# Altium project Feeder.PrjPCB
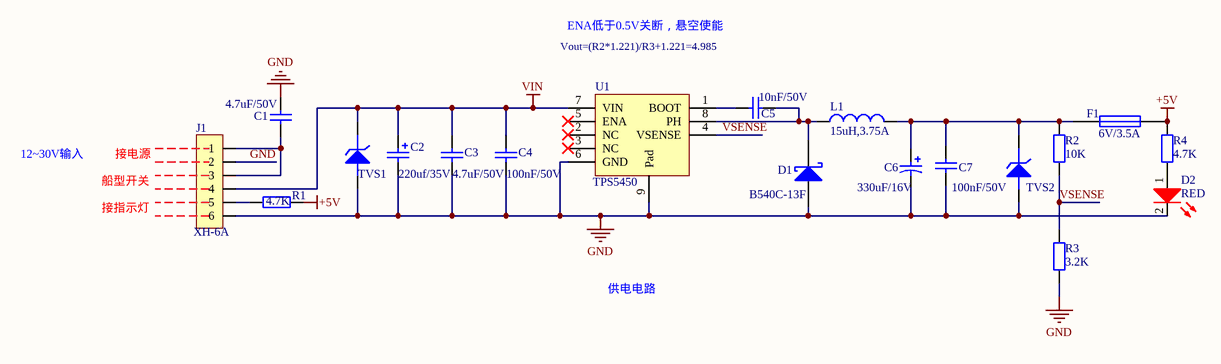
[diagram p0: Power.SchDoc]
5 sheets, 131 parts. Net scope: global (net labels, ports and power ports of the same name join across sheets).
Board file: Feeder.PcbDoc
Sheets:
  Power.SchDoc
  MCU.SchDoc
  Motor.SchDoc
  Communicate.SchDoc
  Display.SchDoc

## Sheet Power.SchDoc
size A4; PageSetup: Record=PageOptions|CenterHorizontal=True|CenterVertical=True|PrintScale=0.97|XCorrection=1.00|YCorrection=1.00|PrintKind=0|BorderSize=5000000|LeftOffset=0|BottomOffset=0|Orientation=2|PaperLength=1000|PaperWidth=1000|Scale=100|PaperSource=7|PrintQuality=-4|MediaType=1|DitherType=10|PaperKind=A4|PrintScaleMode=1

### Parts
C1  4.7uF/50V  [0603C]
C2  220uf/35V  [CES-8x10R5mm]
C3  4.7uF/50V  [0603C]
C4  100nF/50V  [0603C]
C5  10nF/50V  [0603C]
C6  330uF/16V  [CES-8 X11R7MM]
C7  100nF/50V  [0603C]
D1  B540C-13F  [SMC]
D2  RED  [0603D]
F1  6V/3.5A  [F1812]
J1  XH-6A  [CN6-2.54]
L1  15uH,3.75A  [L12*12*6]
R1  4.7K  [0603R]
R2  10K  [0603R]
R3  3.2K  [0603R]
R4  4.7K  [0603R]
TVS1  1SMA26CAT3G  [DO-214AC]  (value not drawn)
TVS2  1SMA6.0AT3D  [DO-214AC]  (value not drawn)
U1  TPS5450  [SOIC8-P]

### Nets
+5V: F1.2 R1.1 R4.2
GND: C1.2 C2.2 C3.1 C4.1 C6.2 C7.1 D1.1 D2.2 J1.2 J1.6 R3.1 TVS1.1 TVS2.1 U1.6(GND) U1.9(Pad)
VIN: C2.1 C3.2 C4.2 J1.4 TVS1.2 U1.7(VIN)
VSENSE: R2.2 R3.2 U1.4(VSENSE)
NetC1_1: C1.1 J1.1 J1.3
NetC5_1: C5.1 U1.1(BOOT)
NetC5_2: C5.2 D1.2 L1.1 U1.8(PH)
NetC6_1: C6.1 C7.2 F1.1 L1.2 R2.1 TVS2.2
NetD2_1: D2.1 R4.1
NetJ1_5: J1.5 R1.2

Not connected (* = marked no-connect by the designer): U1 2(NC)* 3(NC)* 5(ENA)*

### Notes on the sheet
- Vout=(R2*1.221)/R3+1.221=4.985
- ENA低于0.5V关断，悬空使能
- 12~30V输入
- 船型开关
- 接指示灯
- 接电源
- 供电电路
- Shen Zhen Strong Technology Co,.LTD
- 深圳市思榕科技有限公司
- Title:
- PN:
- APPD（核准）:
- Date:
- CHK（审核）:
- DR（绘图）:
- Rev:
- Sheet:
- of

### Library data of the parts
C1 C3 = C4.7uF-0603: 瓷片电容,4.7uF,5%,X7R,50V,0603; 料号: 10201-47042-00; 品名: 瓷片电容
C2 = C220uf/35V-8*11.5: 铝电解电容,220uF,20%,35V,8*11.5; 料号: 10202-22069-00; 品名: 铝电解电容
C4 C7 = C100nF/50V-0603: 瓷片电容,100nF,5%,X7R,50V,0603; 料号: 10201-10032-00; 品名: 瓷片电容
C5 = C10nF/50V-0603: 瓷片电容,10nF,5%,X7R,50V,0603; 料号: 10201-10022-00; 品名: 瓷片电容
C6 = C330uF/16V-8*11.7: 铝电解电容，330uF/16V，8*11.7; 品名: 铝电解电容; 料号: 10202-3307G-00
D1 = B540C-13-F: 肖特基二极管, 40V/5A, SMC（DO-214AB）封装; 料号: 10403-00014-00; 品名: 肖特基二极管
D2 = LED-RED-0603: LED，红光，0603; 料号: 10406-00008-00; 品名: 发光二极管
F1 = F-6V/3.5A: 保险丝,6V,3.5A,慢断,1812封装; 料号: 11001-00023-00; 品名: 保险丝
J1 = CONN-XH-6A: CONN,XH-6A,6PIN,2.54mm插座; 料号: 10701-00013-00; 品名: 线对板连接器
L1 = L15uH-12*12*6: 744771115，15uH，±20%，3.75A，外形尺寸：12x12x6mm; 料号: 10301-01014-00; 品名: 功率电感
R1 R4 = R4.7K-0603: 金属膜电阻,4.7K,1%,1/10W,0603; 料号: 10101-47012-00; 品名: 金属膜电阻
R2 = R10K-0603-0.1%: 金属膜电阻,10K,0.1%,1/10W,0603; 料号: 10101-1002B-00; 品名: 金属膜电阻
R3 = R3.2K-0603-0.1%: 金属膜电阻,3.2KK,0.1%,1/10W,0603; 料号: 10101-03201-00; 品名: 金属膜电阻
TVS1 = 1SMA26CAT3G: TVS管，1SMA26CAT3G，DO214AC封装（SMA）; 料号: 10405-00033-00; 品名: TVS管
TVS2 = 1SMA6.0AT3D: TVS管，1SMA6.0AT3D，DO214AC封装（SMA）; 料号: 10405-00035-00; 品名: TVS管
U1 = TPS5450: 线性稳压器，SOIC-8封装，; 产品料号: 10604-00141-00; 品名: 电源芯片

## Sheet MCU.SchDoc
size A4; PageSetup: Record=PageOptions|CenterHorizontal=True|CenterVertical=True|PrintScale=0.97|XCorrection=1.00|YCorrection=1.00|PrintKind=0|BorderSize=5000000|LeftOffset=0|BottomOffset=0|Orientation=2|PaperLength=1000|PaperWidth=1000|Scale=100|PaperSource=7|PrintQuality=-4|MediaType=1|DitherType=10|PaperKind=A4|PrintScaleMode=1
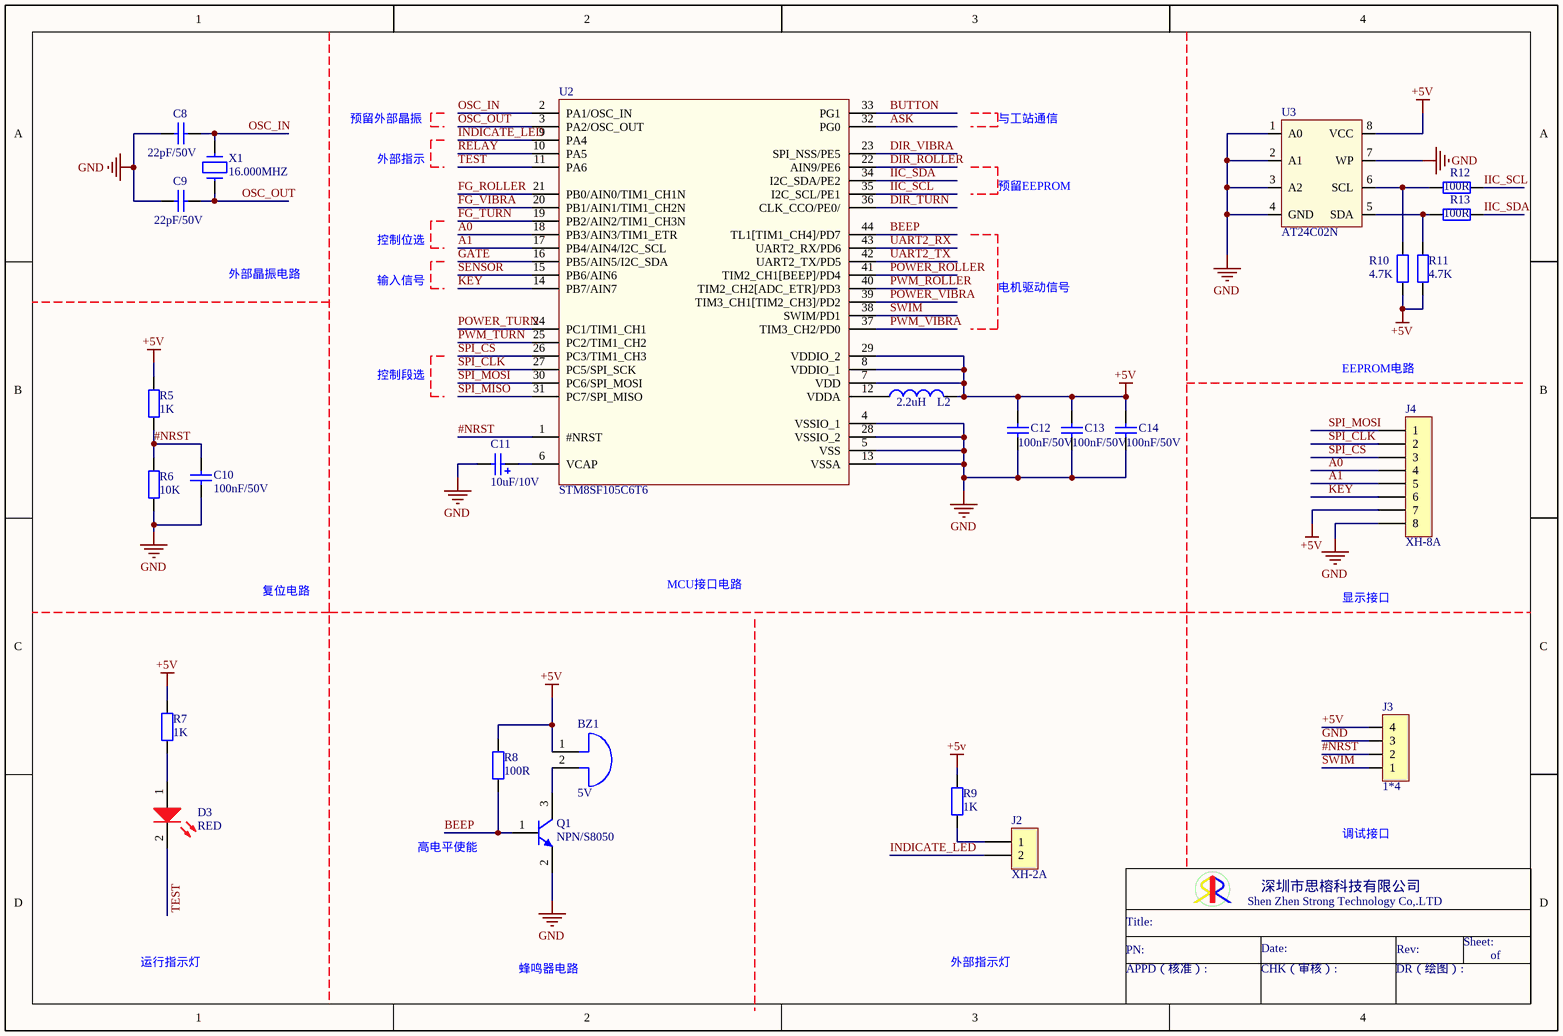
[diagram p1: MCU.SchDoc]

### Parts
BZ1  5V  [BUZZER]
C8  22pF/50V  [0603C]
C9  22pF/50V  [0603C]
C10  100nF/50V  [0603C]
C11  10uF/10V  [3216]
C12  100nF/50V  [0603C]
C13  100nF/50V  [0603C]
C14  100nF/50V  [0603C]
D3  RED  [0603D]
J2  XH-2A  [CN2-2.54]
J3  1*4  [SIP4-2.54mm]
J4  XH-8A  [PH2.0MM-8PIN]
L2  2.2uH  [0805L]
Q1  NPN/S8050  [SOT-23]
R5  1K  [0603R]
R6  10K  [0603R]
R7  1K  [0603R]
R8  100R  [0603R]
R9  1K  [0603R]
R10  4.7K  [0603R]
R11  4.7K  [0603R]
R12  100R  [0603R]
R13  100R  [0603R]
U2  STM8SF105C6T6  [LQFP44]
U3  AT24C02N  [SOP8]
X1  16.000MHZ  [CRYL3*5]

### Nets
+5V: BZ1.1 C12.2 C13.2 C14.2 J3.4 J4.7 L2.2 R5.2 R7.1 R8.2 R9.2 R10.1 R11.1 U2.7(VDD) U2.8(VDDIO_1) U2.29(VDDIO_2) U3.8(VCC)
GND: C8.2 C9.2 C10.1 C11.2 C12.1 C13.1 C14.1 J3.3 J4.8 Q1.2(E) R6.1 U2.4(VSSIO_1) U2.5(VSS) U2.13(VSSA) U2.28(VSSIO_2) U3.1(A0) U3.2(A1) U3.3(A2) U3.4(GND) U3.7(WP)
#NRST: C10.2 J3.2 R5.1 R6.2 U2.1(#NRST)
A0: J4.4 U2.18(PB3/AIN3/TIM1_ETR)
A1: J4.5 U2.17(PB4/AIN4/I2C_SCL)
ASK: U2.32(PG0)
BEEP: Q1.1(B) R8.1 U2.44(TL1[TIM1_CH4]/PD7)
BUTTON: U2.33(PG1)
DIR_ROLLER: U2.22(AIN9/PE6)
DIR_TURN: U2.36(CLK_CCO/PE0/)
DIR_VIBRA: U2.23(SPI_NSS/PE5)
FG_ROLLER: U2.21(PB0/AIN0/TIM1_CH1N)
FG_TURN: U2.19(PB2/AIN2/TIM1_CH3N)
FG_VIBRA: U2.20(PB1/AIN1/TIM1_CH2N)
GATE: U2.16(PB5/AIN5/I2C_SDA)
IIC_SCL: R12.2 U2.35(I2C_SCL/PE1)
IIC_SDA: R13.2 U2.34(I2C_SDA/PE2)
INDICATE_LED: J2.2 U2.9(PA4)
KEY: J4.6 U2.14(PB7/AIN7)
OSC_IN: C8.1 U2.2(PA1/OSC_IN) X1.2
OSC_OUT: C9.1 U2.3(PA2/OSC_OUT) X1.1
POWER_ROLLER: U2.41(TIM2_CH1[BEEP]/PD4)
POWER_TURN: U2.24(PC1/TIM1_CH1)
POWER_VIBRA: U2.39(TIM3_CH1[TIM2_CH3]/PD2)
PWM_ROLLER: U2.40(TIM2_CH2[ADC_ETR]/PD3)
PWM_TURN: U2.25(PC2/TIM1_CH2)
PWM_VIBRA: U2.37(TIM3_CH2/PD0)
RELAY: U2.10(PA5)
SENSOR: U2.15(PB6/AIN6)
SPI_CLK: J4.2 U2.27(PC5/SPI_SCK)
SPI_CS: J4.3 U2.26(PC3/TIM1_CH3)
SPI_MISO: U2.31(PC7/SPI_MISO)
SPI_MOSI: J4.1 U2.30(PC6/SPI_MOSI)
SWIM: J3.1 U2.38(SWIM/PD1)
TEST: D3.2 U2.11(PA6)
UART2_RX: U2.43(UART2_RX/PD6)
UART2_TX: U2.42(UART2_TX/PD5)
NetBZ1_2: BZ1.2 Q1.3(C)
NetC11_1: C11.1 U2.6(VCAP)
NetD3_1: D3.1 R7.2
NetJ2_1: J2.1 R9.1
NetL2_1: L2.1 U2.12(VDDA)
NetR10_2: R10.2 R12.1 U3.6(SCL)
NetR11_2: R11.2 R13.1 U3.5(SDA)

### Notes on the sheet
- 预留外部晶振
- 外部指示
- 与工站通信
- 控制位选
- 预留EEPROM
- 外部晶振电路
- 输入信号
- 电机驱动信号
- 控制段选
- EEPROM电路
- 复位电路
- MCU接口电路
- 显示接口
- 高电平使能
- 调试接口
- 运行指示灯
- 蜂鸣器电路
- 外部指示灯
- Shen Zhen Strong Technology Co,.LTD
- 深圳市思榕科技有限公司
- Title:
- PN:
- APPD（核准）:
- Date:
- CHK（审核）:
- DR（绘图）:
- Rev:
- Sheet:
- of

### Library data of the parts
BZ1 = BEEP-5V: Ф11.8*9.5，DC5V; 料号: 11302-00002-00; 品名: 蜂鸣器
C8 C9 = C22pF/50V-0603: 瓷片电容,22pF,5%,X7R,50V,0603; 料号: 10201-02202-00; 品名: 瓷片电容
C10 C12-C14 = C100nF/50V-0603: as C4 on sheet Power; 品名: 瓷片电容
C11 = C10uF/10V-A: 钽电容,10uF,10%,10V,3216(A); 料号: 10203-10053-00; 品名: 钽电容
D3 = LED-RED-0603: as D2 on sheet Power
J2 = CONN-XH-2A: CONN,XH-2A,2PIN,2.54mm插座; 料号: 10701-00001-00; 品名: 线对板连接器
J3 = SIP1*4-FM: 单排母，1*4,2.54mm; 料号: 10701-00084-00; 品名: 线对板连接器
J4 = CONN-XH-8A: CONN,XH-8A,8PIN,2.54mm插座; 料号: 10701-00016-00; 品名: 线对板连接器
L2 = L2.2uH-0805: 磁珠,2.2uH,0805; 料号: 10302-2U203-00; 品名: 磁珠
Q1 = S8050: NPN型三极管，S8050，SOT－23; 料号: 10501-00001-00; 品名: NPN型三极管
R5 R7 R9 = R1K-0603: 金属膜电阻,1K,1%,1/10W,0603; 料号: 10101-10012-00; 品名: 金属膜电阻
R6 = R10K-0603: 金属膜电阻,10K,1%,1/10W,0603; 料号: 10101-10022-00; 品名: 金属膜电阻
R8 R12 R13 = R100R-0603: 金属膜电阻,100R,1%,1/10W,0603; 料号: 10101-10002-00; 品名: 金属膜电阻
R10 R11 = R4.7K-0603: as R1 on sheet Power; 品名: 金属膜电阻
U2 = STM8SF105C6T6: MCU,STM8SF105C6T6,LQFP44; 料号: 10601-00045-3H; 品名: MCU
U3 = AT24C02N: IC，AT24C02N，SOP8; 料号: 10603-00003-5H; 品名: 存储器
X1 = CRYSTAL: 无源晶振，16.000MHZ，贴片2脚，5.0*3.2*1.2; 品名: 无源晶振

## Sheet Motor.SchDoc
size A4; PageSetup: Record=PageOptions|CenterHorizontal=True|CenterVertical=True|PrintScale=0.97|XCorrection=1.00|YCorrection=1.00|PrintKind=0|BorderSize=5000000|LeftOffset=0|BottomOffset=0|Orientation=2|PaperLength=1000|PaperWidth=1000|Scale=100|PaperSource=7|PrintQuality=-4|MediaType=1|DitherType=10|PaperKind=A4|PrintScaleMode=1
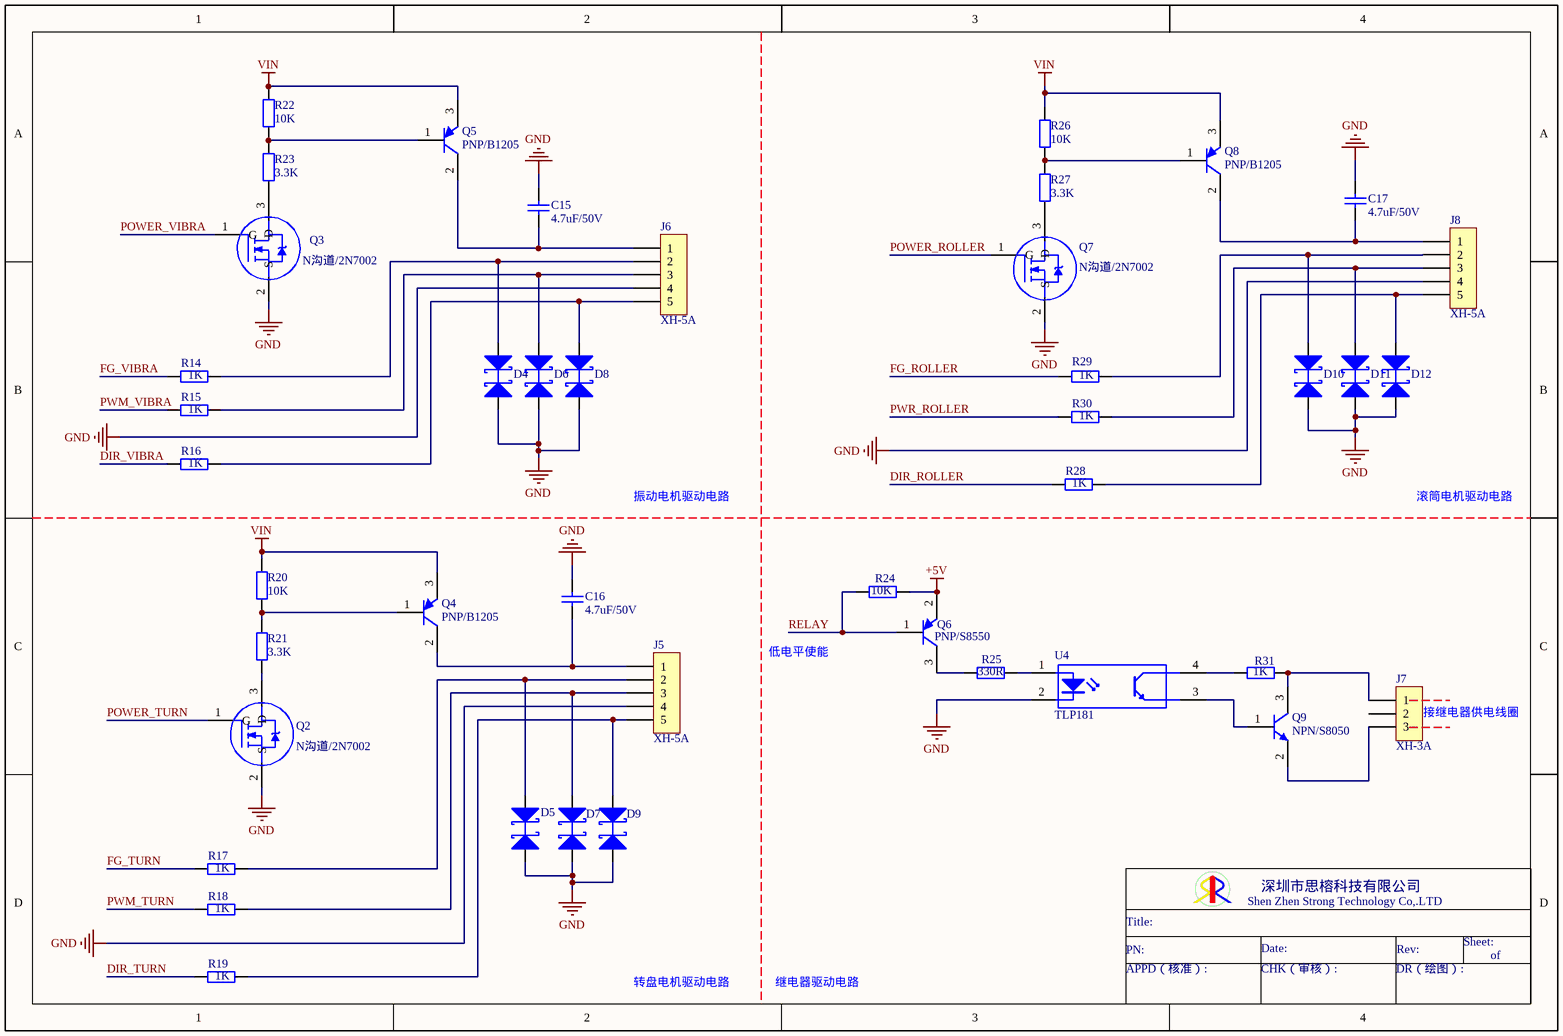
[diagram p2: Motor.SchDoc]

### Parts
C15  4.7uF/50V  [0603C]
C16  4.7uF/50V  [0603C]
C17  4.7uF/50V  [0603C]
D4  ESD5B5.0ST1G  [SOD-523]  (value not drawn)
D5  ESD5B5.0ST1G  [SOD-523]  (value not drawn)
D6  ESD5B5.0ST1G  [SOD-523]  (value not drawn)
D7  ESD5B5.0ST1G  [SOD-523]  (value not drawn)
D8  ESD5B5.0ST1G  [SOD-523]  (value not drawn)
D9  ESD5B5.0ST1G  [SOD-523]  (value not drawn)
D10  ESD5B5.0ST1G  [SOD-523]  (value not drawn)
D11  ESD5B5.0ST1G  [SOD-523]  (value not drawn)
D12  ESD5B5.0ST1G  [SOD-523]  (value not drawn)
J5  XH-5A  [CN5-2.54]
J6  XH-5A  [CN5-2.54]
J7  XH-3A  [CN3-2.54]
J8  XH-5A  [CN5-2.54]
Q2  N沟道/2N7002  [SOT-23]
Q3  N沟道/2N7002  [SOT-23]
Q4  PNP/B1205  [TO-252]
Q5  PNP/B1205  [TO-252]
Q6  PNP/S8550  [SOT-23]
Q7  N沟道/2N7002  [SOT-23]
Q8  PNP/B1205  [TO-252]
Q9  NPN/S8050  [TO-92MOD]
R14  1K  [0603R]
R15  1K  [0603R]
R16  1K  [0603R]
R17  1K  [0603R]
R18  1K  [0603R]
R19  1K  [0603R]
R20  10K  [0603R]
R21  3.3K  [0805R]
R22  10K  [0603R]
R23  3.3K  [0805R]
R24  10K  [0603R]
R25  330R  [0603R]
R26  10K  [0603R]
R27  3.3K  [0805R]
R28  1K  [0603R]
R29  1K  [0603R]
R30  1K  [0603R]
R31  1K  [0603R]
U4  TLP181  [SOP4-2.54]

### Nets
+5V: Q6.2(E) R24.1
GND: C15.2 C16.2 C17.2 D4.2 D5.2 D6.2 D7.2 D8.2 D9.2 D10.2 D11.2 D12.2 J5.4 J6.4 J8.4 Q2.2(S) Q3.2(S) Q7.2(S) U4.2(K)
VIN: Q4.3(E) Q5.3(E) Q8.3(E) R20.1 R22.2 R26.1
DIR_ROLLER: R28.1
DIR_TURN: R19.1
DIR_VIBRA: R16.1
FG_ROLLER: R29.1
FG_TURN: R17.1
FG_VIBRA: R14.1
POWER_ROLLER: Q7.1(G)
POWER_TURN: Q2.1(G)
POWER_VIBRA: Q3.1(G)
PWM_TURN: R18.1
PWM_VIBRA: R15.1
PWR_ROLLER: R30.1
RELAY: Q6.1(B) R24.2
NetC15_1: C15.1 J6.1 Q5.2(C)
NetC16_1: C16.1 J5.1 Q4.2(C)
NetC17_1: C17.1 J8.1 Q8.2(C)
NetD4_1: D4.1 J6.2 R14.2
NetD5_1: D5.1 J5.2 R17.2
NetD6_1: D6.1 J6.3 R15.2
NetD7_1: D7.1 J5.3 R18.2
NetD8_1: D8.1 J6.5 R16.2
NetD9_1: D9.1 J5.5 R19.2
NetD10_1: D10.1 J8.2 R29.2
NetD11_1: D11.1 J8.3 R30.2
NetD12_1: D12.1 J8.5 R28.2
NetJ7_1: J7.1 Q9.3(C) R31.2
NetJ7_3: J7.3 Q9.2(E)
NetQ2_3: Q2.3(D) R21.1
NetQ3_3: Q3.3(D) R23.1
NetQ4_1: Q4.1(B) R20.2 R21.2
NetQ5_1: Q5.1(B) R22.1 R23.2
NetQ6_3: Q6.3(C) R25.1
NetQ7_3: Q7.3(D) R27.1
NetQ8_1: Q8.1(B) R26.2 R27.2
NetQ9_1: Q9.1(B) U4.3(E)
NetR25_2: R25.2 U4.1(A)
NetR31_1: R31.1 U4.4(C)

Not connected (* = marked no-connect by the designer): J7 2

### Notes on the sheet
- 振动电机驱动电路
- 滚筒电机驱动电路
- 低电平使能
- (near J7) 接继电器供电线圈
- 转盘电机驱动电路
- 继电器驱动电路
- Shen Zhen Strong Technology Co,.LTD
- 深圳市思榕科技有限公司
- Title:
- PN:
- APPD（核准）:
- Date:
- CHK（审核）:
- DR（绘图）:
- Rev:
- Sheet:
- of

### Library data of the parts
C15-C17 = C4.7uF-0603: as C1 on sheet Power; 品名: 瓷片电容
D4-D12 = ESD5B5.0ST1G: TVS管,5V,SOD-523; 料号: 10405-00037-00; 品名: TVS管
J5 J6 J8 = CONN-XH-5A: CONN,XH-5A,5PIN,2.54mm插座; 料号: 10701-00010-00; 品名: 线对板连接器
J7 = CONN-XH-3A: CONN,XH-3A,3PIN,2.54mm插座; 料号: 10701-00004-00; 品名: 线对板连接器
Q2 Q3 Q7 = 2N7002: N沟道场效应管，2N7002，SOT-23; 料号: 10503-00003-1H; 品名: N沟道场效应管
Q4 Q5 Q8 = B1205: PNP型三极管，B1205，SOT－23; 品名: PNP型三极管
Q6 = S8550: PNP型三极管，S8550，SOT－23; 料号: 10502-00001-00; 品名: PNP型三极管
Q9 = S8050: NPN型三极管，S8050，SOT－23; 料号: 10501-00001-00; 品名: NPN型三极管
R14-R19 R28-R31 = R1K-0603: as R5 on sheet MCU; 品名: 金属膜电阻
R20 R22 R24 R26 = R10K-0603: as R6 on sheet MCU; 品名: 金属膜电阻
R21 R23 R27 = R3.3K-0603: 金属膜电阻,3.3K,1%,1/10W,0603; 料号: 10101-33012-00; 品名: 金属膜电阻
R25 = R33R-0805: 金属膜电阻,330R,1%,1/10W,0603; 料号: 10101-03303-00; 品名: 金属膜电阻
U4 = TLP181: 光耦，TLP181，SOP4; 料号: 10609-00009-9J; 品名: 光耦

## Sheet Communicate.SchDoc
size A4; PageSetup: Record=PageOptions|CenterHorizontal=True|CenterVertical=True|PrintScale=0.97|XCorrection=1.00|YCorrection=1.00|PrintKind=0|BorderSize=5000000|LeftOffset=0|BottomOffset=0|Orientation=2|PaperLength=1000|PaperWidth=1000|Scale=100|PaperSource=7|PrintQuality=-4|MediaType=1|DitherType=10|PaperKind=A4|PrintScaleMode=1
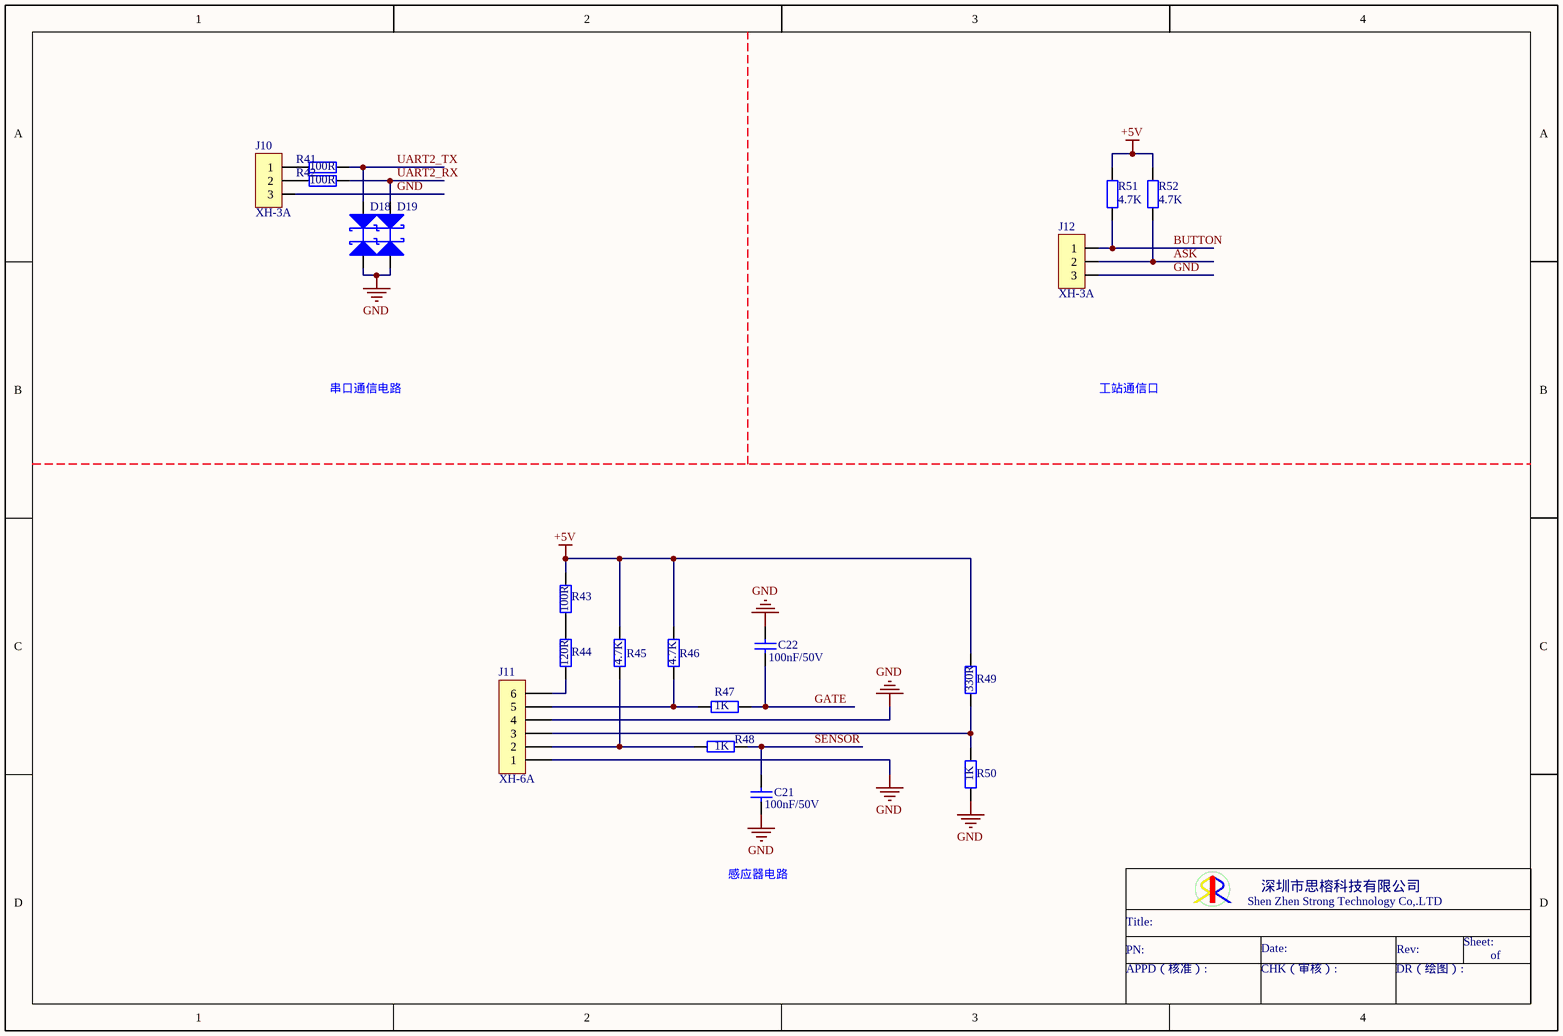
[diagram p3: Communicate.SchDoc]

### Parts
C21  100nF/50V  [0603C]
C22  100nF/50V  [0603C]
D18  ESD5B5.0ST1G  [SOD-523]  (value not drawn)
D19  ESD5B5.0ST1G  [SOD-523]  (value not drawn)
J10  XH-3A  [CN3-2.54]
J11  XH-6A  [CN6-2.54]
J12  XH-3A  [CN3-2.54]
R41  100R  [0603R]
R42  100R  [0603R]
R43  100R  [0603R]
R44  120R  [0603R]
R45  4.7K  [0603R]
R46  4.7K  [0603R]
R47  1K  [0603R]
R48  1K  [0603R]
R49  330R  [0603R]
R50  1K  [0603R]
R51  4.7K  [0603R]
R52  4.7K  [0603R]

### Nets
+5V: R43.2 R45.2 R46.2 R49.2 R51.2 R52.2
GND: C21.1 C22.1 D18.1 D19.1 J10.3 J11.1 J11.4 J12.3 R50.1
ASK: J12.2 R52.1
BUTTON: J12.1 R51.1
GATE: C22.2 R47.2
SENSOR: C21.2 R48.2
UART2_RX: D19.2 R42.2
UART2_TX: D18.2 R41.2
NetJ10_1: J10.1 R41.1
NetJ10_2: J10.2 R42.1
NetJ11_2: J11.2 R45.1 R48.1
NetJ11_3: J11.3 R49.1 R50.2
NetJ11_5: J11.5 R46.1 R47.1
NetJ11_6: J11.6 R44.1
NetR43_1: R43.1 R44.2

### Notes on the sheet
- 串口通信电路
- 工站通信口
- 感应器电路
- Shen Zhen Strong Technology Co,.LTD
- 深圳市思榕科技有限公司
- Title:
- PN:
- APPD（核准）:
- Date:
- CHK（审核）:
- DR（绘图）:
- Rev:
- Sheet:
- of

### Library data of the parts
C21 C22 = C100nF/50V-0603: as C4 on sheet Power; 品名: 瓷片电容
D18 D19 = ESD5B5.0ST1G: TVS管,5V,SOD-523; 料号: 10405-00037-00; 品名: TVS管
J10 J12 = CONN-XH-3A: as J7 on sheet Motor
J11 = CONN-XH-6A: as J1 on sheet Power
R41-R43 = R100R-0603: as R8 on sheet MCU; 品名: 金属膜电阻
R44 = R120R: 金属膜电阻,120R,5W,5%; 料号: 10107-12000-00; 品名: 金属膜电阻
R45 R46 R51 R52 = R4.7K-0603: as R1 on sheet Power; 品名: 金属膜电阻
R47 R48 R50 = R1K-0603: as R5 on sheet MCU; 品名: 金属膜电阻
R49 = R330R-0603: 金属膜电阻,330R,1%,1/10W,0603; 料号: 10101-33002-00; 品名: 金属膜电阻

## Sheet Display.SchDoc
size A4; PageSetup: Record=PageOptions|CenterHorizontal=True|CenterVertical=True|PrintScale=0.97|XCorrection=1.00|YCorrection=1.00|PrintKind=0|BorderSize=5000000|LeftOffset=0|BottomOffset=0|Orientation=2|PaperLength=1000|PaperWidth=1000|Scale=100|PaperSource=7|PrintQuality=-4|MediaType=1|DitherType=10|PaperKind=A4|PrintScaleMode=1
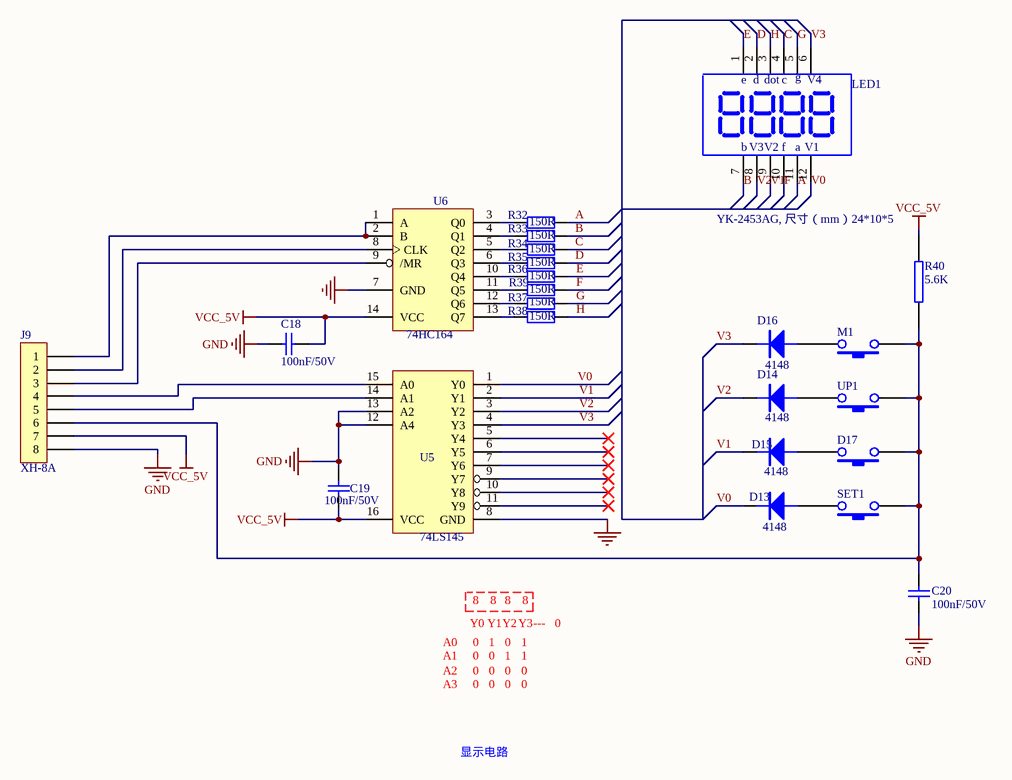
[diagram p4: Display.SchDoc]

### Parts
C18  100nF/50V  [0603C]
C19  100nF/50V  [0603C]
C20  100nF/50V  [0603C]
D13  4148  [LL-34]
D14  4148  [LL-34]
D15  4148  [LL-34]
D16  4148  [LL-34]
D17  (no value)  [SW6545]
J9  XH-8A  [PH2.0MM-8PIN]
LED1  YK-2453AG, 尺寸（mm）24*10*5  [DigitalTube_4W]
M1  (no value)  [SW6545]
R32  150R  [0805R]
R33  150R  [0805R]
R34  150R  [0805R]
R35  150R  [0805R]
R36  150R  [0805R]
R37  150R  [0805R]
R38  150R  [0805R]
R39  150R  [0805R]
R40  5.6K  [0603R]
SET1  (no value)  [SW6545]
U5  74LS145  [SO-16]
U6  74HC164  [SO-14]
UP1  (no value)  [SW6545]

### Nets
GND: C18.2 C19.2 C20.1 J9.8 U5.8(GND) U5.12(A4) U5.13(A2) U6.7(GND)
VCC_5V: C18.1 C19.1 J9.7 R40.2 U5.16(VCC) U6.14(VCC)
A: LED1.11 R32.2
B: LED1.7(B) R33.2
C: LED1.4 R34.2
D: LED1.2 R35.2
E: LED1.1 R36.2
F: LED1.10 R39.2
G: LED1.5 R37.2
H: LED1.3 R38.2
V0: D13.2(K) LED1.12 U5.1(Y0)
V1: D15.2(K) LED1.9 U5.2(Y1)
V2: D14.2(K) LED1.8 U5.3(Y2)
V3: D16.2(K) LED1.6 U5.4(Y3)
NetC20_2: C20.2 D17.1 J9.6 M1.1 R40.1 SET1.1 UP1.1
NetD13_1: D13.1(A) SET1.2
NetD14_1: D14.1(A) UP1.2
NetD15_1: D15.1(A) D17.2
NetD16_1: D16.1(A) M1.2
NetJ9_1: J9.1 U6.1(A) U6.2(B)
NetJ9_2: J9.2 U6.8(CLK)
NetJ9_3: J9.3 U6.9(/MR)
NetJ9_4: J9.4 U5.15(A0)
NetJ9_5: J9.5 U5.14(A1)
NetR32_1: R32.1 U6.3(Q0)
NetR33_1: R33.1 U6.4(Q1)
NetR34_1: R34.1 U6.5(Q2)
NetR35_1: R35.1 U6.6(Q3)
NetR36_1: R36.1 U6.10(Q4)
NetR37_1: R37.1 U6.12(Q6)
NetR38_1: R38.1 U6.13(Q7)
NetR39_1: R39.1 U6.11(Q5)

Not connected (* = marked no-connect by the designer): U5 5(Y4)* 6(Y5)* 7(Y6)* 9(Y7)* 10(Y8)* 11(Y9)*

### Notes on the sheet
- 8
- A2
- A1
- A0
- Y0
- 0
- Y1
- 1
- Y2
- Y3
- ---
- A3
- 显示电路
- Shen Zhen Strong Technology Co,.LTD
- 深圳市思榕科技有限公司
- Title:
- PN:
- APPD（核准）:
- Date:
- CHK（审核）:
- DR（绘图）:
- Rev:
- Sheet:
- of
- (in symbol 数码管，红色，共阴，尺寸（mm）24*10*5) e; d; dot; c; g; V4; b; V3; V2; f; a; V1

### Library data of the parts
C18-C20 = C100nF/50V-0603: as C4 on sheet Power; 品名: 瓷片电容
D13-D16 = DIODE
D17 M1 SET1 UP1 = SW-PB
J9 = CONN-XH-8A: as J4 on sheet MCU
LED1 = 数码管，红色，共阴，尺寸（mm）24*10*5: 品名: YK-2453AG, 尺寸（mm）24*10*5
R32-R39 = R150R-0805: 金属膜电阻,150R,1%,1/8W,0805; 料号: 10101-15003-00; 品名: 金属膜电阻
R40 = RES2
U5 = 74LS595
U6 = 74LS164

## Nets that join several sheets
+5V: Power (F1.2 R1.1 R4.2), MCU (17 pins), Motor (Q6.2 R24.1), Communicate (6 pins)
GND: Power (15 pins), MCU (20 pins), Motor (19 pins), Communicate (9 pins), Display (8 pins)
VIN: Power (6 pins), Motor (6 pins)
ASK: MCU (U2.32), Communicate (J12.2 R52.1)
BUTTON: MCU (U2.33), Communicate (J12.1 R51.1)
DIR_ROLLER: MCU (U2.22), Motor (R28.1)
DIR_TURN: MCU (U2.36), Motor (R19.1)
DIR_VIBRA: MCU (U2.23), Motor (R16.1)
FG_ROLLER: MCU (U2.21), Motor (R29.1)
FG_TURN: MCU (U2.19), Motor (R17.1)
FG_VIBRA: MCU (U2.20), Motor (R14.1)
GATE: MCU (U2.16), Communicate (C22.2 R47.2)
POWER_ROLLER: MCU (U2.41), Motor (Q7.1)
POWER_TURN: MCU (U2.24), Motor (Q2.1)
POWER_VIBRA: MCU (U2.39), Motor (Q3.1)
PWM_TURN: MCU (U2.25), Motor (R18.1)
PWM_VIBRA: MCU (U2.37), Motor (R15.1)
RELAY: MCU (U2.10), Motor (Q6.1 R24.2)
SENSOR: MCU (U2.15), Communicate (C21.2 R48.2)
UART2_RX: MCU (U2.43), Communicate (D19.2 R42.2)
UART2_TX: MCU (U2.42), Communicate (D18.2 R41.2)